# Altium schematic sheet MCU.SchDoc: Top Level
size A3; CompanyName: NOT USED; DocumentNumber: 7; SheetNumber: 7; SheetTotal: 10; PageSetup: Record=PageOptions|CenterHorizontal=True|CenterVertical=True|PrintScale=1.00|XCorrection=1.00|YCorrection=1.00|PrintKind=0|BorderSize=5000000|LeftOffset=0|BottomOffset=0|Orientation=2|PaperLength=1000|PaperWidth=1000|Scale=100|PaperSource=7|PrintQuality=-4|MediaType=1|DitherType=10|PaperKind=A3|PrintScaleMode=0
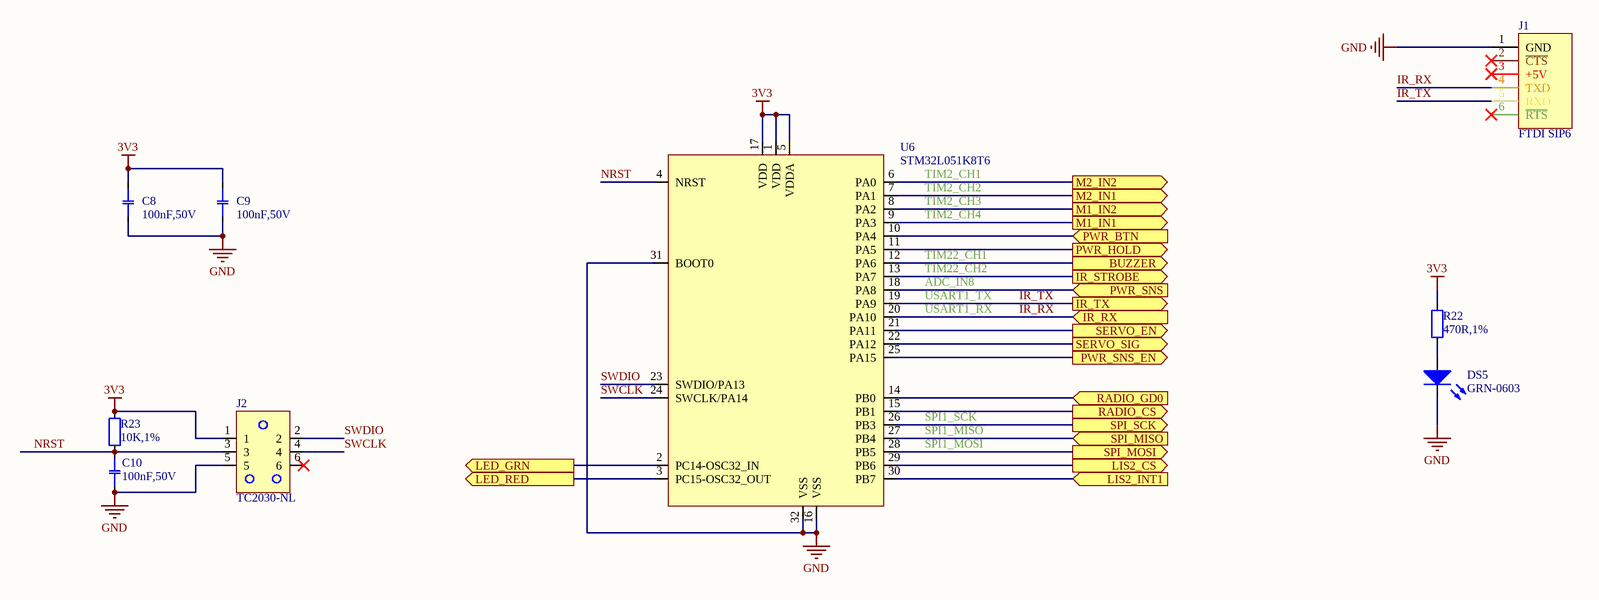
[diagram p0: MCU.SchDoc]

## Parts
C8  100nF,50V  [CAPC1608X09N_0603]
C9  100nF,50V  [CAPC1608X09N_0603]
C10  100nF,50V  [CAPC1608X09N_0603]
DS5  GRN-0603  [LED_SML-LX0603]
J1  FTDI SIP6  [HIROSE_A2-6PA-2.54DSA]
J2  TC2030-NL  [TAGCON_TC2030-IDC-NL]  (no BOM)
R22  470R,1%  [RESC1608X06N_0603]
R23  10K,1%  [RESC1608X06N_0603]
U6  STM32L051K8T6  [LQFP32]

## Ports
BUZZER (out), IR_RX (in), IR_STROBE (out), IR_TX (out), LED_GRN (out), LED_RED (out), LIS2_CS (out), LIS2_INT1 (in), M1_IN1 (out), M1_IN2 (out), M2_IN1 (out), M2_IN2 (out), PWR_BTN (in), PWR_HOLD (out), PWR_SNS (in), PWR_SNS_EN (out), RADIO_CS (out), RADIO_GD0 (in), SERVO_EN (out), SERVO_SIG (out), SPI_MISO (in), SPI_MOSI (out), SPI_SCK (out)

## Nets
3V3: C8.2 C9.2 J2.1 R22.2 R23.2 U6.1(VDD) U6.5(VDDA) U6.17(VDD)
GND: C8.1 C9.1 C10.2 DS5.1(C) J1.1(GND) J2.5 U6.16(VSS) U6.31(BOOT0) U6.32(VSS)
BUZZER: U6.12(PA6) ; port BUZZER
IR_RX: J1.4(TXD) U6.20(PA10) ; port IR_RX
IR_STROBE: U6.13(PA7) ; port IR_STROBE
IR_TX: J1.5(RXD) U6.19(PA9) ; port IR_TX
LED_GRN: U6.2(PC14-OSC32_IN) ; port LED_GRN
LED_RED: U6.3(PC15-OSC32_OUT) ; port LED_RED
LIS2_CS: U6.29(PB6) ; port LIS2_CS
LIS2_INT1: U6.30(PB7) ; port LIS2_INT1
M1_IN1: U6.9(PA3) ; port M1_IN1
M1_IN2: U6.8(PA2) ; port M1_IN2
M2_IN1: U6.7(PA1) ; port M2_IN1
M2_IN2: U6.6(PA0) ; port M2_IN2
NRST: C10.1 J2.3 R23.1 U6.4(NRST)
PWR_BTN: U6.10(PA4) ; port PWR_BTN
PWR_HOLD: U6.11(PA5) ; port PWR_HOLD
PWR_SNS: U6.18(PA8) ; port PWR_SNS
PWR_SNS_EN: U6.25(PA15) ; port PWR_SNS_EN
RADIO_CS: U6.15(PB1) ; port RADIO_CS
RADIO_GD0: U6.14(PB0) ; port RADIO_GD0
SERVO_EN: U6.21(PA11) ; port SERVO_EN
SERVO_SIG: U6.22(PA12) ; port SERVO_SIG
SPI_MISO: U6.27(PB4) ; port SPI_MISO
SPI_MOSI: U6.28(PB5) ; port SPI_MOSI
SPI_SCK: U6.26(PB3) ; port SPI_SCK
SWCLK: J2.4 U6.24(SWCLK/PA14)
SWDIO: J2.2 U6.23(SWDIO/PA13)
NetDS5_2: DS5.2(A) R22.1

Not connected (* = marked no-connect by the designer): J1 2(~{CTS})* 3(+5V)* 6(~{RTS})*; J2 6*

## Notes on the sheet
- (near U6) TIM2_CH1
- (near U6) TIM2_CH2
- (near U6) TIM2_CH3
- (near U6) TIM2_CH4
- (near U6) USART1_TX
- (near U6) ADC_IN8
- (near U6) TIM22_CH1
- (near U6) TIM22_CH2
- (near U6) USART1_RX
- (near U6) SPI1_SCK
- (near U6) SPI1_MISO
- (near U6) SPI1_MOSI
- Project
- Size:
- Date:
- A3
- Revision:
- Sheet
- of
- Lambo
- File:

## Library data of the parts
C8-C10 = CCH-104CH-G: CAP CER 0.1UF 50V 10% X7R 0603; Manufacturer: Kemet; Manufacturer Part Number: C0603C104K5RACTU; Type: Ceramic; Display_Name: 100nF,50V; Capacitance: 100nF; Dielectric: X7R; Tolerance: 10%; Voltage: 50V; BWA PN: CCH-104CH-G; Schematic Symbol: CAP-NP_1; Supplier 1: Digi-Key; Supplier Part Number 1: 399-5089-1-ND
DS5 = LED-10087-A: LED GREEN CLEAR 0603 SMD; Manufacturer: Dialight; Manufacturer Part Number: 5988081107F; Wavelength: 523nm; Axial Intensity: 300mcd; If(max): 20mA; Lens Style/Size: 0603; Vf@I: 3.2V; Viewing Angle: 140; Display_Name: GRN-0603; BWA PN: LED-10087-A; Colour: GREEN; Lens type: clear; Vr(max): -; Schematic Symbol: LED_1; Supplier 1: Digi-Key; Supplier Part Number 1: 350-2036-1-ND
J1 = CON-10749-A: FTDI Serial Header; Manufacturer: Hirose Electric Co Ltd; Manufacturer Part Number: A2-6PA-2.54DSA(71); Contacts: 6; Pitch: 2.54mm; Rows: 1; Display_Name: FTDI SIP6; Type: Header; BWA PN: CON-10749-A; Schematic Symbol: FTDI_TTL_232R; Supplier 1: Digi-Key; Supplier Part Number 1: H123043-ND
J2 = NONPART-056: Tag connect 6 way - No Legs; Display_Name: TC2030-NL; BWA PN: NONPART-056; Schematic Symbol: TAGCON_TC2030-IDC
R22 = RSH-470R0-D: RES 470 OHM 1/10W 1% 0603 SMD; Manufacturer: Rohm Semiconductor; Manufacturer Part Number: MCR03EZPFX4700; Power: 0.1W; Display_Name: 470R,1%; Resistance: 470R; Tolerance: 1%; Type: Chip; BWA PN: RSH-470R0-D; Schematic Symbol: RESISTOR_1; Supplier 1: Digi-Key; Supplier Part Number 1: RHM470HCT-ND
R23 = RSH-10K00-D: RES 10.0K OHM 1/10W 1% 0603 SMD; Manufacturer: Yageo; Manufacturer Part Number: RC0603FR-0710KL; Power: 0.1W; Display_Name: 10K,1%; Resistance: 10K; Tolerance: 1%; Type: Chip; BWA PN: RSH-10K00-D; Schematic Symbol: RESISTOR_1; Supplier 1: Digi-Key; Supplier Part Number 1: 311-10.0KHRCT-ND
U6 = ICT-10696-A: 32 Bit Mcirocontroler; Manufacturer: ST Microelectronics; Temp Range: -40°C ~ 85°C; Display_Name: STM32L051K8T6; BWA PN: ICT-10696-A; Schematic Symbol: STM32L051x6/8; Manufacturer Part Number: STM32L051K8T6; Supplier 1: Digi-Key; Supplier Part Number 1: 497-14901-ND